# EAGLE board blades_v40 (EAGLE 5.09), part 1 of 2
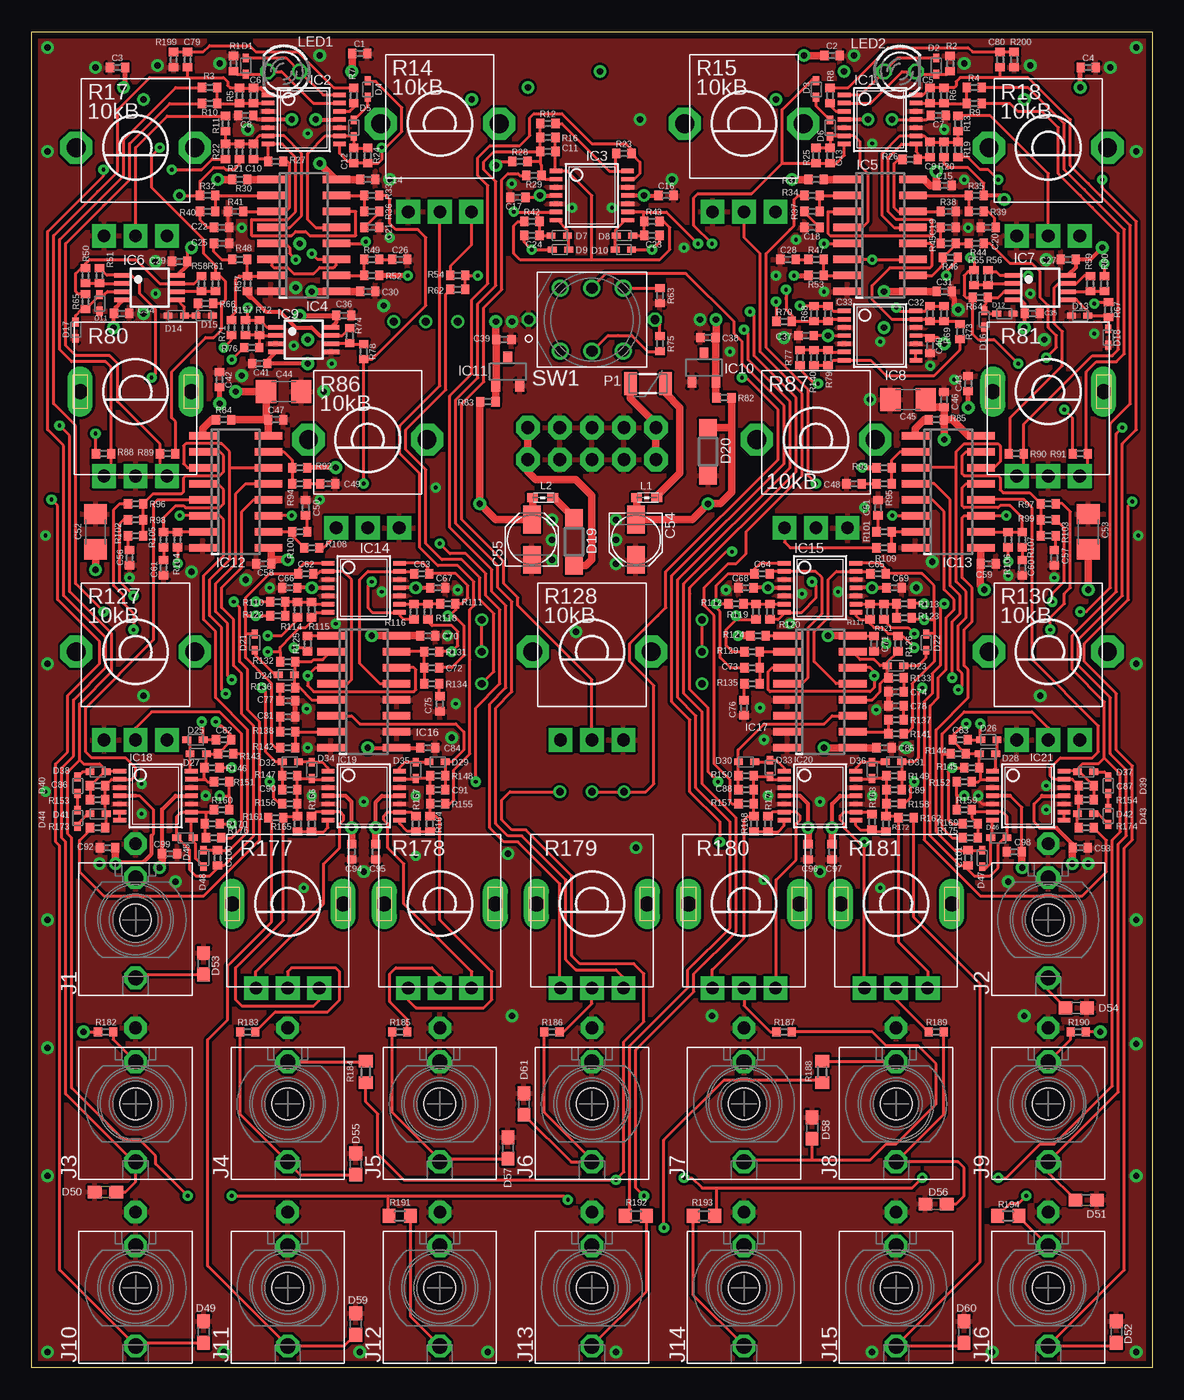
[diagram p6: board, top side]
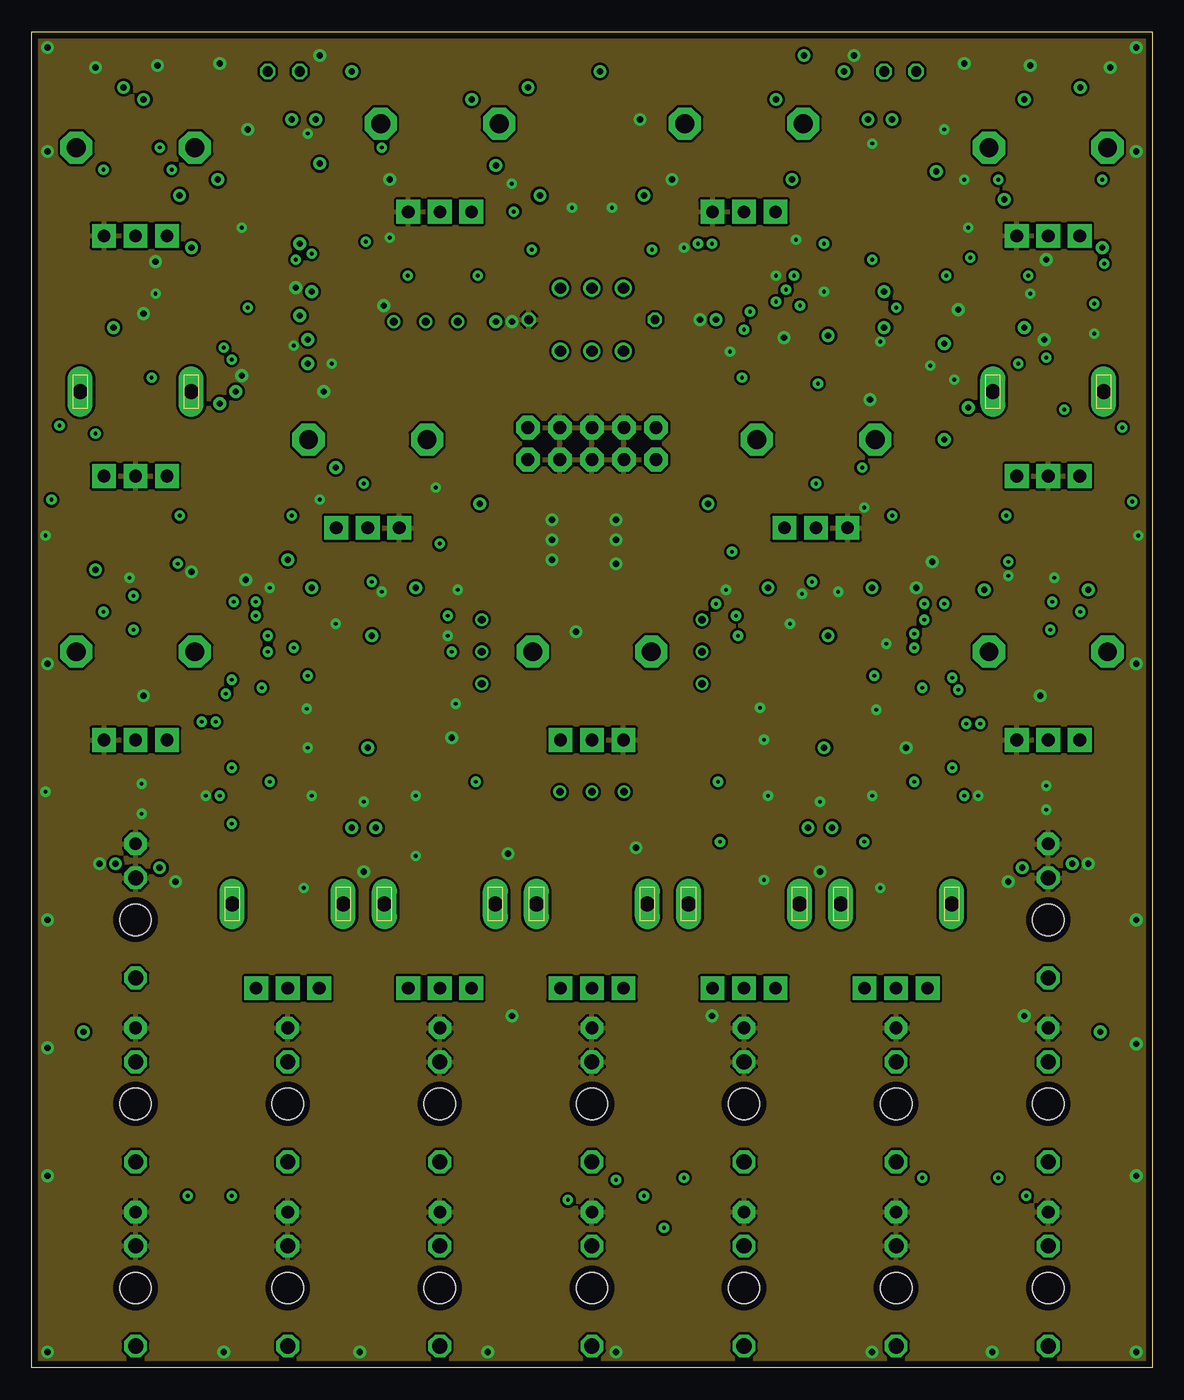
[diagram p7: board, inner layer InternalGround]
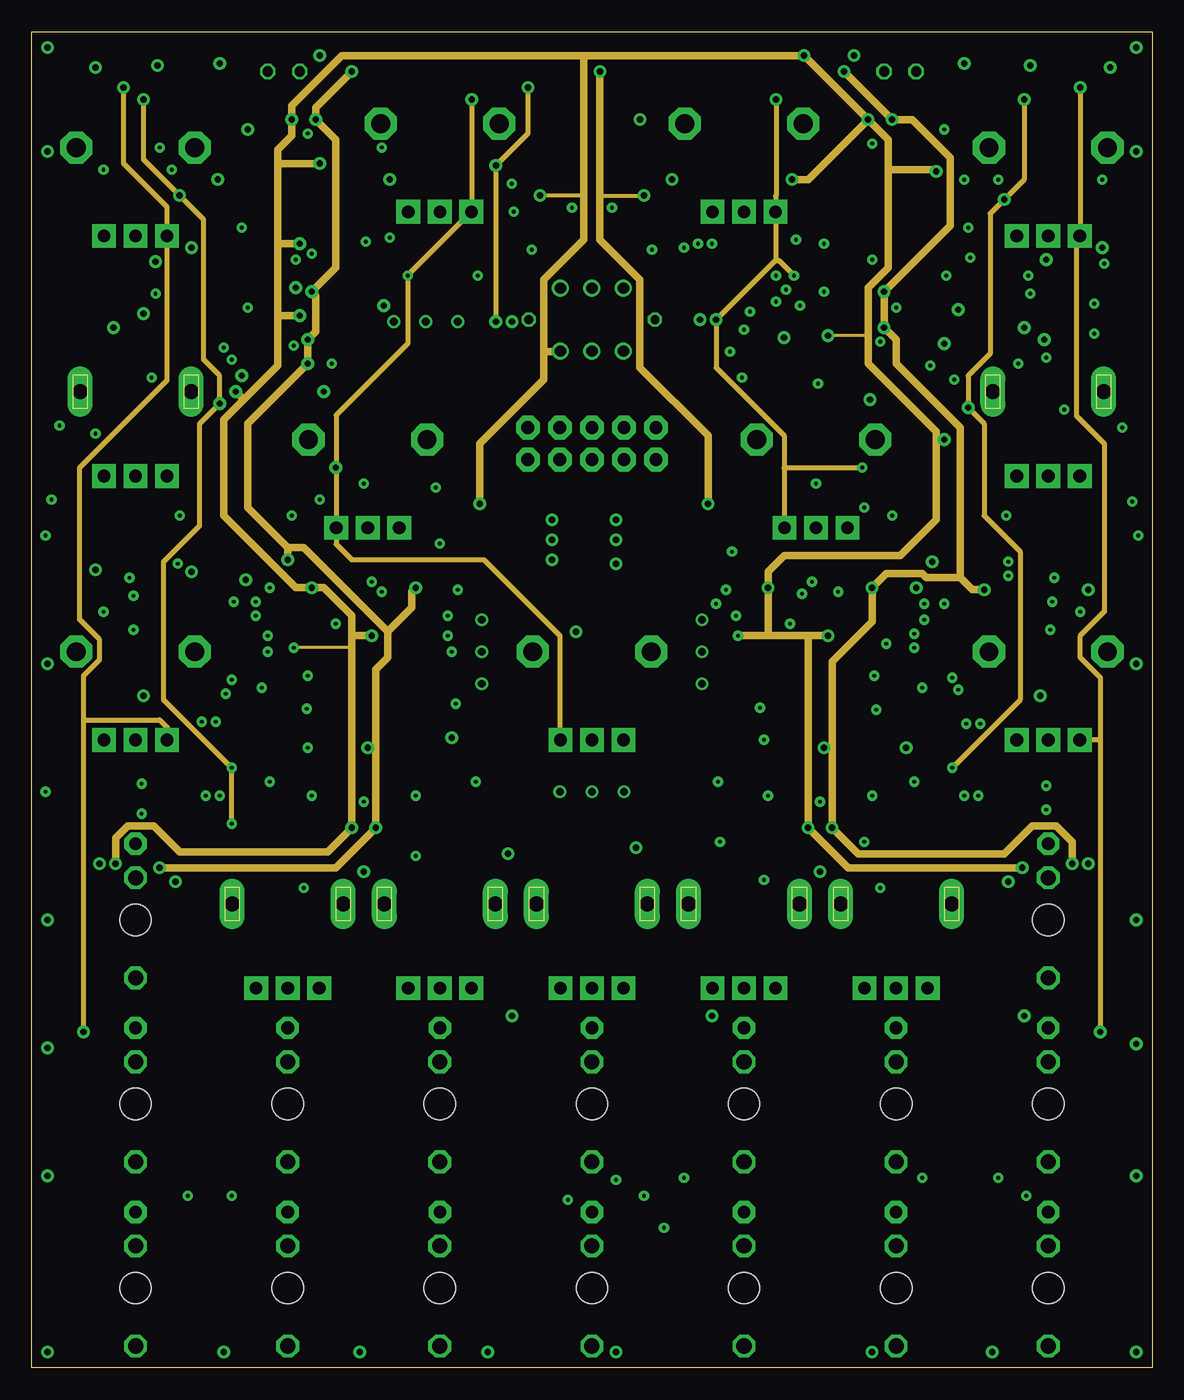
[diagram p8: board, inner layer Supplies]
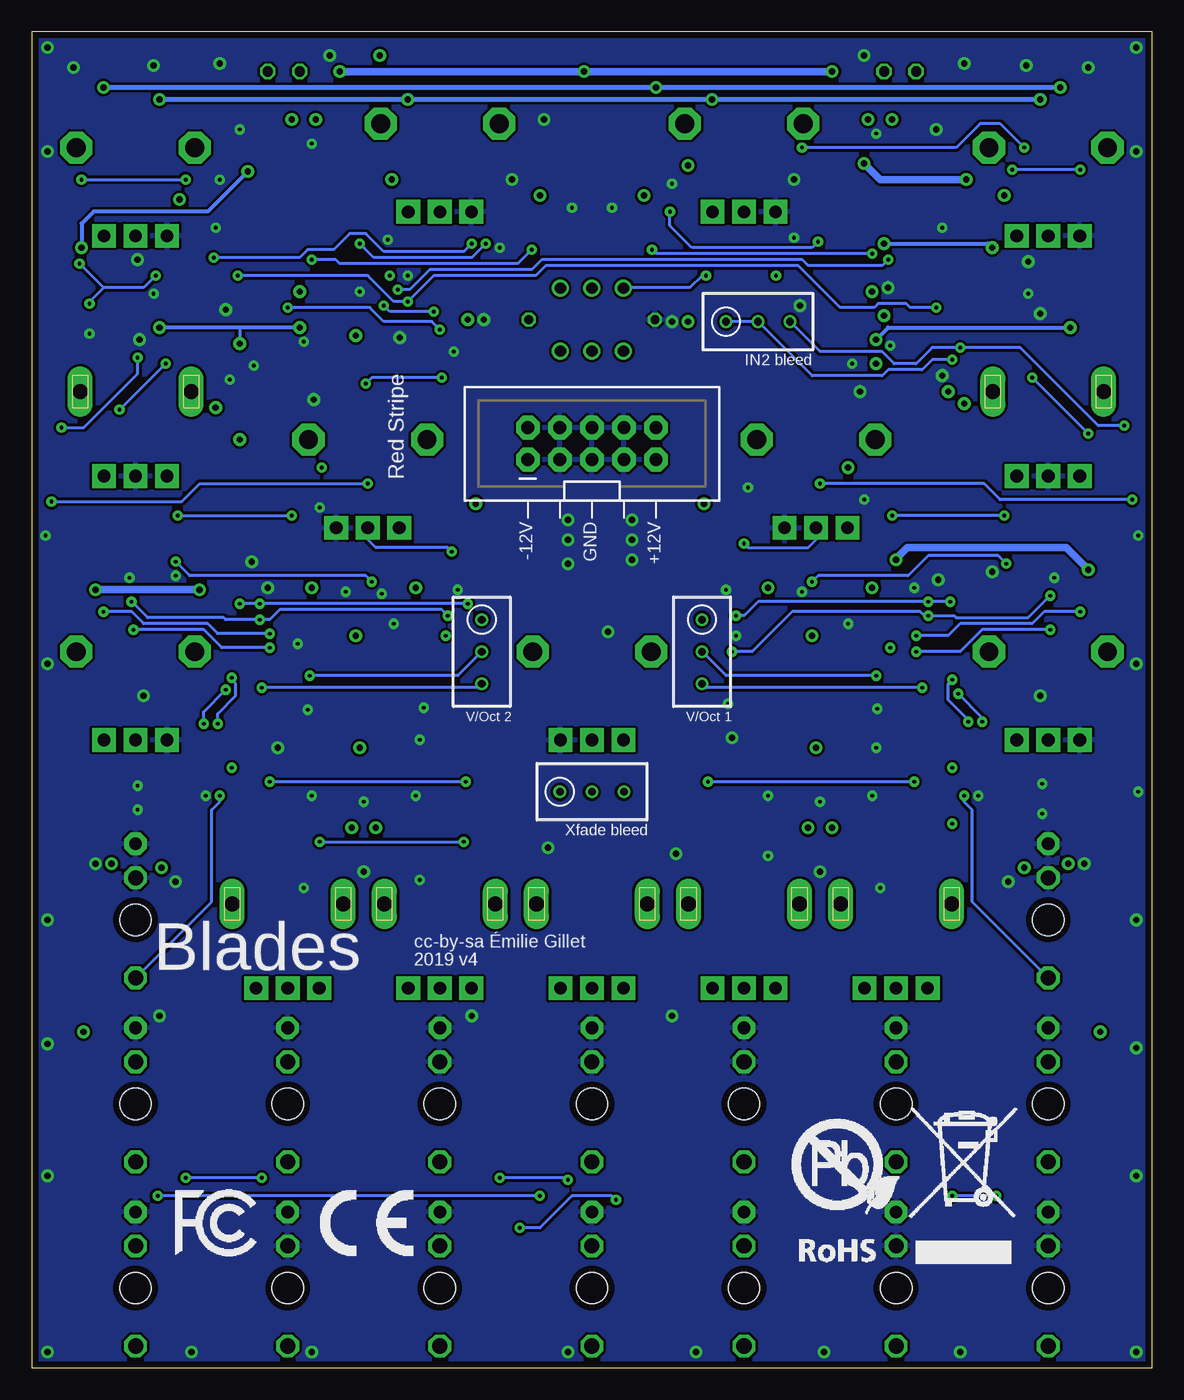
[diagram p9: board, bottom side, seen from below]

Size 88.9 x 106.05 mm. Coordinates in mm from the lower left corner, seen from the top.
Outline: 0,0 0,106.05 88.9,106.05 88.9,0 0,0
Copper layers (1+2*15+16): Top 0.05mm / dielectric 0.3mm / InternalGround 0.05mm / dielectric 0.75mm / Supplies 0.035mm / dielectric 0.2mm / Bottom 0.05mm
Design rules "PCBCart-Standard-4L *": minimum track width 8mil, minimum drill 0.3mm, track to track 8mil, track to pad 8mil, pad to pad 8mil, via to via 8mil, smd to smd 8mil, copper to edge 20mil, drill to drill 8mil, minimum pad ring 8mil, minimum via ring 10mil, stop-mask expansion 3mil, vias tented up to drill 25mil, thermal gap 8mil

## Footprints (pad centres in the part's own frame; a part is rotated, then mirrored left to right if it is on the bottom)
C0402 = smd 0.65 x 0.75: 1 -0.6,0; 2 0.6,0
C1206 = smd 1.6 x 1.8: 1 -1.4,0; 2 1.4,0
PANASONIC_B = smd 2.2 x 1.4: + 1.6,0; - -1.6,0
SOD523 = smd 0.7 x 0.5: A 0.7,0; C -0.6,0
SOD123 = smd 1.4 x 1.4: A 1.9,0; C -1.9,0
0603 = smd 1.1 x 1: 1 -0.85,0; 2 0.85,0
TSSOP14_065 = smd 0.35 x 1: 1 -1.95,-2.845; 2 -1.3,-2.845; 3 -0.65,-2.845; 4 0,-2.845; 5 0.65,-2.845; 6 1.3,-2.845; 7 1.95,-2.845; 8 1.95,2.845; 9 1.3,2.845; 10 0.65,2.845; 11 0,2.845; 12 -0.65,2.845; 13 -1.3,2.845; 14 -1.95,2.825
SOIC16N = smd 0.6 x 2.2: 1 -4.445,-2.6; 2 -3.175,-2.6; 3 -1.905,-2.6; 4 -0.635,-2.6; 5 0.635,-2.6; 6 1.905,-2.6; 7 3.175,-2.6; 8 4.445,-2.6; 9 4.445,2.6; 10 3.175,2.6; 11 1.905,2.6; 12 0.635,2.6; 13 -0.635,2.6; 14 -1.905,2.6; 15 -3.175,2.6; 16 -4.445,2.6
VSSOP8 = smd 0.35 x 1.2: 1 -0.975,-2.2; 2 -0.325,-2.2; 3 0.325,-2.2; 4 0.975,-2.2; 5 0.975,2.2; 6 0.325,2.2; 7 -0.325,2.2; 8 -0.975,2.2
DBZ_R-PDSO-G3 = smd 0.7 x 1: 1 -0.95,-1.1; 2 0.95,-1.1; 3 0,1.1
WQP_PJ_301M_TME = drill 1 pad 1.778 octagon: P1 0,-6.032 | drill 1.2 pad 1.778 octagon: P2 0,-3.334; P3 0,4.604 | hole 2.5: 0,0
2X5-SHROUDED = drill 1.016 pad 1.88 octagon: 1 -1.27,5.08; 2 1.27,5.08; 3 -1.27,2.54; 4 1.27,2.54; 5 -1.27,0; 6 1.27,0; 7 -1.27,-2.54; 8 1.27,-2.54; 9 -1.27,-5.08; 10 1.27,-5.08
0603' = smd 0.85 x 0.7: 1 -0.9,0; 2 0.7,0
LED3MM = drill 0.813 octagon: A -1.27,0; K 1.27,0
PTC-1206 = smd 1 x 1.8: 1 -1.4,0; 2 1.4,0
R0402 = smd 0.65 x 0.75: 1 -0.6,0; 2 0.6,0
ALPS_POT_VERTICAL_PS = drill 1 pad 1.88 square: P$1 -2.5,7; P$2 0,7; P$3 2.5,7 | drill 1.5 pad 2.54 octagon: P$4 -4.7,0; P$5 4.7,0
ALPS_POT_NARROW = drill 1 pad 1.88 square: P$1 -2.5,6.7; P$2 0,6.7; P$3 2.5,6.7 | drill 1.2 pad 2 long: P$4 -4.4,0; P$5 4.4,0
RTRIM3296W = drill 0.61 round: 1 0,-2.54; 2 0,0; 3 0,2.54
R0603 = smd 1 x 1.1: 1 -0.85,0; 2 0.85,0
LP4OA1PBCT = drill 0.7 octagon: L1 5,0; L2 -5,0 | drill 0.9 round: P1 2.5,2.5; P2 0,2.5; P3 -2.5,2.5; P4 2.5,-2.5; P5 0,-2.5; P6 -2.5,-2.5

## Placement (x,y rotation side)
C1  100n  [C0402]  26.04,104.3 180 top
C2  100n  [C0402]  63.5,104.14 0 top
C3  100n  [C0402]  6.83,103.19 180 top
C4  100n  [C0402]  83.82,103.19 0 top
C5  18p  [C0402]  71.28,100.97 90 top
C6  18p  [C0402]  17.62,100.97 90 top
C7  100n  [C0402]  71.91,99.38 180 top
C8  100n  [C0402]  16.99,99.38 180 top
C9  220p  [C0402]  71.28,96.68 270 top
C10  220p  [C0402]  17.62,96.52 270 top
C11  220p  [C0402]  40.96,96.52 0 top
C12  18p  [C0402]  25.56,96.2 270 top
C13  18p  [C0402]  63.34,96.2 270 top
C14  100n  [C0402]  26.67,94.3 0 top
C15  100n  [C0402]  72.39,93.82 0 top
C16  100n  [C0402]  50.32,93.03 180 top
C17  100n  [C0402]  38.58,92.87 180 top
C18  560p  [C0402]  61.91,90.49 180 top
C19  560p  [C0402]  72.71,90.49 0 top
C20  560p  [C0402]  75.88,90.49 180 top
C21  560p  [C0402]  26.99,90.49 0 top
C22  560p  [C0402]  15.08,90.49 0 top
C23  220p  [C0402]  49.21,89.85 0 top
C24  220p  [C0402]  39.69,89.85 180 top
C25  560p  [C0402]  15.08,89.22 0 top
C26  560p  [C0402]  29.21,87.95 0 top
C27  100n  [C0402]  82.23,87.95 180 top
C28  560p  [C0402]  60.01,87.95 180 top
C29  100n  [C0402]  11.75,87.79 180 top
C30  100n  [C0402]  26.67,85.41 180 top
C31  100n  [C0402]  72.39,85.41 180 top
C32  18p  [C0402]  71.28,83.66 90 top
C33  18p  [C0402]  63.18,83.66 90 top
C34  100n  [C0402]  7.14,83.66 180 top
C35  100n  [C0402]  79.37,83.66 180 top
C36  100n  [C0402]  24.77,83.5 0 top
C37  100n  [C0402]  61.44,81.92 180 top
C38  100n  [C0402]  53.66,81.76 180 top
C39  100n  [C0402]  37.47,81.6 0 top
C40  100n  [C0402]  71.28,81.12 90 top
C41  100n  [C0402]  18.1,79.69 0 top
C42  100n  [C0402]  14.92,78.42 90 top
C43  100n  [C0402]  74.3,78.11 90 top
C44  22u  [C1206]  20,77.47 0 top
C45  22u  [C1206]  69.53,76.83 180 top
C46  100n  [C0402]  72.39,76.83 90 top
C47  100n  [C0402]  19.37,75.25 0 top
C48  560p  [C0402]  65.25,70.17 180 top
C49  560p  [C0402]  23.49,70.17 0 top
C50  560p  [C0402]  21.75,68.26 90 top
C51  560p  [C0402]  67.15,68.26 90 top
C52  22u  [C1206]  5.08,66.36 270 top
C53  22u  [C1206]  83.82,66.36 270 top
C54  22u  [PANASONIC_B]  47.94,65.72 270 top
C55  22u  [PANASONIC_B]  39.69,65.72 90 top
C56  560p  [C0402]  7.78,64.29 270 top
C57  560p  [C0402]  81.12,64.29 270 top
C58  100n  [C0402]  18.41,63.82 0 top
C59  100n  [C0402]  75.88,63.82 180 top
C60  560p  [C0402]  78.58,63.5 270 top
C61  560p  [C0402]  10.48,63.5 270 top
C62  220p  [C0402]  21.75,63.02 180 top
C63  220p  [C0402]  30.96,63.02 0 top
C64  220p  [C0402]  57.94,63.02 180 top
C65  220p  [C0402]  67.15,63.02 0 top
C66  100n  [C0402]  20.48,61.91 180 top
C67  100n  [C0402]  32.23,61.91 180 top
C68  100n  [C0402]  56.67,61.91 180 top
C69  100n  [C0402]  68.42,61.91 180 top
C70  100n  [C0402]  31.43,58.1 0 top
C71  100n  [C0402]  66.83,57.47 270 top
C72  DNP  [C0402]  31.75,55.56 0 top
C73  DNP  [C0402]  57.15,55.56 180 top
C74  560p  [C0402]  68.58,53.66 180 top
C75  560p  [C0402]  32.39,52.71 270 top
C76  560p  [C0402]  56.52,52.39 270 top
C77  560p  [C0402]  20.32,52.94 0 top
C78  560p  [C0402]  68.58,52.55 180 top
C79  100n  [C0402]  12.38,103.82 90 top
C80  100n  [C0402]  76.83,103.82 90 top
C81  560p  [C0402]  20.32,51.67 0 top
C82  220p  [C0402]  15.24,49.85 180 top
C83  220p  [C0402]  73.66,49.85 0 top
C84  100n  [C0402]  31.43,49.21 180 top
C85  100n  [C0402]  67.63,49.21 180 top
C86  18p  [C0402]  5.24,46.2 180 top
C87  18p  [C0402]  83.66,46.2 0 top
C88  220p  [C0402]  56.67,45.88 180 top
C89  220p  [C0402]  68.42,45.88 0 top
C90  220p  [C0402]  20.48,45.88 180 top
C91  220p  [C0402]  32.23,45.88 0 top
C92  100n  [C0402]  6.03,41.27 180 top
C93  100n  [C0402]  83.19,41.27 180 top
C94  100n  [C0402]  25.4,40.96 270 top
C95  100n  [C0402]  27.3,40.96 90 top
C96  100n  [C0402]  61.59,40.96 270 top
C97  100n  [C0402]  63.5,40.96 90 top
C98  100n  [C0402]  77.95,40.96 180 top
C99  100n  [C0402]  10.95,40.8 180 top
C100  220p  [C0402]  14.76,40.48 90 top
C101  220p  [C0402]  74.3,40.48 90 top
D1  1N4148  [SOD523]  16.99,103.35 270 top
D2  1N4148  [SOD523]  71.75,103.35 270 top
D3  BZT585B5V1T  [SOD523]  62.23,101.44 90 top
D4  BZT585B5V1T  [SOD523]  26.67,101.44 90 top
D5  BZT585B5V1T  [SOD523]  25.56,98.42 270 top
D6  BZT585B5V1T  [SOD523]  63.34,98.42 270 top
D7  1N4148  [SOD523]  41.91,89.85 180 top
D8  1N4148  [SOD523]  46.99,89.85 0 top
D9  1N4148  [SOD523]  41.91,88.74 0 top
D10  1N4148  [SOD523]  46.99,88.74 180 top
D11  1N4148  [SOD523]  5.4,84.46 90 top
D12  1N4148  [SOD523]  77.15,83.66 0 top
D13  1N4148  [SOD523]  83.18,83.5 180 top
D14  1N4148  [SOD523]  11.43,83.5 0 top
D15  1N4148  [SOD523]  13.65,83.5 0 top
D16  1N4148  [SOD523]  75.56,83.18 90 top
D17  1N4148  [SOD523]  3.49,82.39 270 top
D18  1N4148  [SOD523]  85.41,81.76 90 top
D19  1N5819HW  [SOD123]  43.02,65.56 270 top
D20  1N5819HW  [SOD123]  53.66,72.71 90 top
D21  BZT585B5V1T  [SOD523]  17.7,57.55 90 top
D22  BZT585B5V1T  [SOD523]  70.96,57.55 90 top
D23  BZT585B5V1T  [SOD523]  68.58,55.72 180 top
D24  BZT585B5V1T  [SOD523]  20.16,55.01 0 top
D25  1N4148  [SOD523]  13.02,49.85 180 top
D26  1N4148  [SOD523]  75.88,49.85 0 top
D27  1N4148  [SOD523]  13.18,48.74 0 top
D28  1N4148  [SOD523]  75.88,48.74 180 top
D29  1N4148  [SOD523]  32.23,48.1 180 top
D30  1N4148  [SOD523]  56.67,48.1 0 top
D31  1N4148  [SOD523]  68.42,48.1 180 top
D32  1N4148  [SOD523]  20.48,48.1 0 top
D33  1N4148  [SOD523]  58.58,47.62 270 top
D34  1N4148  [SOD523]  22.23,47.47 270 top
D35  1N4148  [SOD523]  30.48,47.47 270 top
D36  1N4148  [SOD523]  66.67,47.47 270 top
D37  BZT585B5V1T  [SOD523]  83.66,47.31 180 top
D38  BZT585B5V1T  [SOD523]  5.24,47.31 0 top
D39  BZT585B5V1T  [SOD523]  85.41,46.2 90 top
D40  BZT585B5V1T  [SOD523]  3.65,46.2 90 top
D41  BZT585B5V1T  [SOD523]  5.24,43.97 0 top
D42  BZT585B5V1T  [SOD523]  83.66,43.97 180 top
D43  BZT585B5V1T  [SOD523]  85.41,43.81 270 top
D44  BZT585B5V1T  [SOD523]  3.65,43.66 270 top
D45  1N4148  [SOD523]  12.22,42.07 180 top
D46  1N4148  [SOD523]  76.68,42.07 0 top
D47  1N4148  [SOD523]  75.41,40.48 270 top
D48  1N4148  [SOD523]  13.65,40.48 270 top
D49  TVS  [0603]  13.65,2.86 270 top
D50  TVS  [0603]  5.87,13.97 0 top
D51  TVS  [0603]  83.66,13.34 180 top
D52  TVS  [0603]  86.04,2.86 270 top
D53  TVS  [0603]  13.65,32.07 270 top
D54  TVS  [0603]  82.87,28.57 180 top
D55  TVS  [0603]  25.72,16.19 270 top
D56  TVS  [0603]  71.75,13.02 0 top
D57  TVS  [0603]  37.78,17.46 270 top
D58  TVS  [0603]  61.91,19.05 270 top
D59  TVS  [0603]  25.72,3.49 270 top
D60  TVS  [0603]  73.98,2.86 270 top
D61  TVS  [0603]  39.05,20.95 270 top
IC1  OPA1679  [TSSOP14_065]  67.31,99.06 270 top
IC2  OPA1679  [TSSOP14_065]  21.59,99.06 270 top
IC3  TL074  [TSSOP14_065]  44.45,93.03 270 top
IC4  V2164SZ  [SOIC16N]  21.59,89.85 270 top
IC5  V2164SZ  [SOIC16N]  67.31,89.85 270 top
IC6  OPA1678  [VSSOP8]  9.37,85.72 270 top
IC7  OPA1678  [VSSOP8]  80.01,85.72 270 top
IC8  OPA1679  [TSSOP14_065]  67.31,81.92 270 top
IC9  OPA1678  [VSSOP8]  21.59,81.6 270 top
IC10  LM4040B5  [DBZ_R-PDSO-G3]  53.34,79.38 0 top
IC11  LM4040B5  [DBZ_R-PDSO-G3]  37.78,79.06 0 top
IC12  V2164SZ  [SOIC16N]  16.19,69.53 270 top
IC13  V2164SZ  [SOIC16N]  72.71,69.53 270 top
IC14  OPA1679  [TSSOP14_065]  26.35,61.91 270 top
IC15  OPA1679  [TSSOP14_065]  62.55,61.91 270 top
IC16  V2164SZ  [SOIC16N]  26.35,53.66 270 top
IC17  V2164SZ  [SOIC16N]  62.55,53.66 270 top
IC18  OPA1679  [TSSOP14_065]  9.84,45.4 270 top
IC19  TL074  [TSSOP14_065]  26.35,45.4 270 top
IC20  TL074  [TSSOP14_065]  62.55,45.4 270 top
IC21  OPA1679  [TSSOP14_065]  79.06,45.4 270 top
J1  PJ301_THONKICONNTME  [WQP_PJ_301M_TME]  8.26,35.56 180 top
J2  PJ301_THONKICONNTME  [WQP_PJ_301M_TME]  80.64,35.56 180 top
J3  PJ301_THONKICONNTME  [WQP_PJ_301M_TME]  8.26,20.95 180 top
J4  PJ301_THONKICONNTME  [WQP_PJ_301M_TME]  20.32,20.95 180 top
J5  PJ301_THONKICONNTME  [WQP_PJ_301M_TME]  32.38,20.95 180 top
J6  PJ301_THONKICONNTME  [WQP_PJ_301M_TME]  44.45,20.95 180 top
J7  PJ301_THONKICONNTME  [WQP_PJ_301M_TME]  56.52,20.95 180 top
J8  PJ301_THONKICONNTME  [WQP_PJ_301M_TME]  68.58,20.95 180 top
J9  PJ301_THONKICONNTME  [WQP_PJ_301M_TME]  80.64,20.95 180 top
J10  PJ301_THONKICONNTME  [WQP_PJ_301M_TME]  8.26,6.35 180 top
J11  PJ301_THONKICONNTME  [WQP_PJ_301M_TME]  20.32,6.35 180 top
J12  PJ301_THONKICONNTME  [WQP_PJ_301M_TME]  32.38,6.35 180 top
J13  PJ301_THONKICONNTME  [WQP_PJ_301M_TME]  44.45,6.35 180 top
J14  PJ301_THONKICONNTME  [WQP_PJ_301M_TME]  56.52,6.35 180 top
J15  PJ301_THONKICONNTME  [WQP_PJ_301M_TME]  68.58,6.35 180 top
J16  PJ301_THONKICONNTME  [WQP_PJ_301M_TME]  80.64,6.35 180 top
JP1  M05X2SHD  [2X5-SHROUDED]  44.45,73.34 90 bottom
L1  742792664  [0603']  48.9,69.06 0 top
L2  742792664  [0603']  40.64,69.06 0 top
LED1  OSC84L3131A  [LED3MM]  20,102.87 180 top
LED2  OSC54L3131A  [LED3MM]  68.9,102.87 0 top
P1  PTCSMD  [PTC-1206]  48.9,78.11 180 top
R1  6.2k  [R0402]  16.03,103.5 90 top
R2  6.2k  [R0402]  72.87,103.5 90 top
R3  5.1k  [R0402]  14.13,101.6 0 top
R4  62.0k  [R0402]  74.77,101.6 180 top
R5  200.0k  [R0402]  16.51,100.97 90 top
R6  200.0k  [R0402]  72.39,100.97 90 top
R7  30k  [R0402]  25.56,100.97 270 top
R8  30k  [R0402]  63.34,100.97 270 top
R9  5.1k  [R0402]  74.77,100.33 180 top
R10  62.0k  [R0402]  14.13,100.33 0 top
R11  62.0k  [R0402]  15.4,98.74 270 top
R12  100.0k  [R0402]  40.96,98.74 180 top
R13  62.0k  [R0402]  73.5,98.74 270 top
R14  10kB  [ALPS_POT_VERTICAL_PS]  32.38,98.74 180 top
R15  10kB  [ALPS_POT_VERTICAL_PS]  56.52,98.74 180 top
R16  100.0k  [R0402]  40.96,97.63 0 top
R17  10kB  [ALPS_POT_VERTICAL_PS]  8.26,96.84 180 top
R18  10kB  [ALPS_POT_VERTICAL_PS]  80.64,96.84 180 top
R19  100k  [R0402]  73.5,96.68 90 top
R20  10M  [R0402]  72.39,96.68 90 top
R21  10M  [R0402]  16.51,96.52 90 top
R22  100k  [R0402]  15.4,96.52 90 top
R23  100.0k  [R0402]  46.99,96.36 180 top
R24  30k  [R0402]  26.67,96.2 270 top
R25  30k  [R0402]  62.23,96.2 270 top
R26  5.1k  [R0402]  69.69,95.89 0 top
R27  5.1k  [R0402]  19.37,95.73 180 top
R28  3.9M  [R0402]  38.73,95.73 0 top
R29  95.3k  [R0402]  39.85,94.62 0 top
R30  6.2k  [R0402]  16.51,94.3 180 top
R31  6.2k  [R0402]  62.23,94.3 180 top
R32  100k  [R0402]  13.97,93.03 0 top
R33  30k  [R0402]  26.99,93.03 180 top
R34  30k  [R0402]  61.91,93.03 0 top
R35  100k  [R0402]  74.93,93.03 180 top
R36  510  [R0402]  26.99,91.76 180 top
R37  510  [R0402]  61.91,91.76 0 top
R38  5.1k  [R0402]  72.71,91.76 180 top
R39  510  [R0402]  74.93,91.76 180 top
R40  510  [R0402]  13.97,91.76 0 top
R41  5.1k  [R0402]  16.19,91.76 0 top
R42  100.0k  [R0402]  39.69,90.96 0 top
R43  100.0k  [R0402]  49.21,90.96 180 top
R44  62.0k  [R0402]  74.93,89.22 180 top
R45  510  [R0402]  72.71,89.22 0 top
R46  62.0k  [R0402]  72.87,88.11 180 top
R47  510  [R0402]  62.23,87.95 0 top
R48  510  [R0402]  16.51,87.95 0 top
R49  510  [R0402]  26.99,87.95 180 top
R50  100k  [R0402]  4.29,86.68 270 top
R51  100k  [R0402]  5.4,86.68 90 top
R52  200.0k  [R0402]  26.99,86.68 180 top
R53  100.0k  [R0402]  62.23,86.68 0 top
R54  88.7k  [R0402]  33.81,86.68 0 top
R55  100k  [R0402]  74.77,86.52 270 top
R56  30k  [R0402]  75.88,86.52 90 top
R57  62.0k  [R0402]  17.14,86.04 90 top
R58  30k  [R0402]  13.49,86.04 90 top
R59  100k  [R0402]  83.98,86.04 90 top
R60  100k  [R0402]  85.09,86.04 270 top
R61  100k  [R0402]  14.6,86.04 270 top
R62  30.0k  [R0402]  33.81,85.57 0 top
R63  100k  [R0402]  49.85,85.09 270 top
R64  100k  [R0402]  75.25,84.93 0 top
R65  100k  [R0402]  4.29,84.61 270 top
R66  100k  [R0402]  13.81,84.45 180 top
R67  100k  [R0402]  85.41,83.98 270 top
R68  62.0k  [R0402]  62.07,83.66 90 top
R69  62.0k  [R0402]  72.39,83.66 90 top
R70  62.0k  [R0402]  59.69,83.03 0 top
R71  62.0k  [R0402]  15.88,82.55 90 top
R72  62.0k  [R0402]  18.1,82.55 90 top
R73  62.0k  [R0402]  73.66,82.23 90 top
R74  30.0k  [R0402]  25.24,81.92 90 top
R75  510  [R0402]  49.85,81.28 90 top
R76  30.0k  [R0402]  17.46,80.96 0 top
R77  30.0k  [R0402]  60.96,80.17 90 top
R78  30.0k  [R0402]  26.35,80.64 90 top
R79  62.0k  [R0402]  63.18,80.17 270 top
R80  10kA  [ALPS_POT_NARROW]  8.26,77.47 180 top
R81  10kA  [ALPS_POT_NARROW]  80.64,77.47 180 top
R82  1.8k  [R0402]  54.93,76.99 180 top
R83  1.8k  [R0402]  36.19,76.68 0 top
R84  680k  [R0402]  15.24,75.25 0 top
R85  680k  [R0402]  71.75,75.25 0 top
R86  10kB  [ALPS_POT_VERTICAL_PS]  26.67,73.66 180 top
R87  10kB  [ALPS_POT_VERTICAL_PS]  62.23,73.66 180 top
R88  5.1k  [R0402]  5.71,72.55 0 top
R89  30k  [R0402]  10.8,72.55 180 top
R90  5.1k  [R0402]  78.11,72.55 0 top
R91  30k  [R0402]  83.19,72.55 0 top
R92  200.0k  [R0402]  21.27,71.44 180 top
R93  200.0k  [R0402]  67.63,71.44 0 top
R94  510  [R0402]  21.27,70.17 180 top
R95  510  [R0402]  67.63,70.17 0 top
R96  62.0k  [R0402]  8.26,68.58 0 top
R97  62.0k  [R0402]  80.65,68.58 180 top
R98  62.0k  [R0402]  8.26,67.31 0 top
R99  62.0k  [R0402]  80.64,67.31 180 top
R100  510  [R0402]  21.27,66.36 180 top
R101  510  [R0402]  67.63,66.36 0 top
R102  510  [R0402]  8.26,66.04 0 top
R103  510  [R0402]  80.64,66.04 180 top
R104  30.0k  [R0402]  11.59,65.72 90 top
R105  510  [R0402]  10.48,65.72 90 top
R106  30.0k  [R0402]  77.47,65.72 90 top
R107  510  [R0402]  78.58,65.72 90 top
R108  200.0k  [R0402]  22.23,65.09 180 top
R109  200.0k  [R0402]  67.63,65.09 0 top
R110  30k  [R0402]  19.53,60.8 180 top
R111  62.0k  [R0402]  33.02,60.64 180 top
R112  62.0k  [R0402]  55.88,60.64 0 top
R113  30k  [R0402]  69.22,60.64 0 top
R114  30k  [R0402]  21.11,60.17 90 top
R115  30k  [R0402]  22.23,60.17 270 top
R116  30.0k  [R0402]  30.32,60.01 270 top
R117  30k  [R0402]  66.52,60.01 270 top
R118  62.0k  [R0402]  31.43,60.01 90 top
R119  62.0k  [R0402]  57.47,60.01 90 top
R120  30.0k  [R0402]  58.58,60.01 270 top
R121  30k  [R0402]  67.63,60.01 90 top
R122  300k  [R0402]  19.53,59.69 180 top
R123  300k  [R0402]  69.22,59.53 0 top
R124  680k  [R0402]  57.63,58.1 180 top
R125  680k  [R0402]  21.91,57.47 270 top
R126  30k  [R0402]  68.74,57.47 270 top
R127  10kB  [ALPS_POT_VERTICAL_PS]  8.26,56.83 180 top
R128  10kB  [ALPS_POT_VERTICAL_PS]  44.45,56.83 180 top
R129  30k  [R0402]  57.15,56.83 0 top
R130  10kB  [ALPS_POT_VERTICAL_PS]  80.64,56.83 180 top
R131  30k  [R0402]  31.75,56.83 180 top
R132  30k  [R0402]  20.32,56.04 0 top
R133  510  [R0402]  68.58,54.77 180 top
R134  510  [R0402]  31.75,54.29 180 top
R135  510  [R0402]  57.15,54.29 0 top
R136  510  [R0402]  20.32,53.98 0 top
R137  510  [R0402]  68.58,51.44 180 top
R138  510  [R0402]  20.32,50.48 0 top
R139  2k  [RTRIM3296W]  44.45,45.72 270 bottom
R140  62.0k  [R0402]  62.07,80.17 270 top
R141  15k  [R0402]  68.58,50.32 180 top
R142  15k  [R0402]  20.32,49.21 0 top
R143  100.0k  [R0402]  15.4,48.74 180 top
R144  100.0k  [R0402]  73.5,48.74 0 top
R145  200.0k  [R0402]  74.57,47.63 0 top
R146  200.0k  [R0402]  14.31,47.62 180 top
R147  30.0k  [R0402]  20.48,46.99 180 top
R148  20k  [R0402]  32.23,46.99 0 top
R149  30.0k  [R0402]  68.42,46.99 0 top
R150  20k  [R0402]  56.67,46.99 180 top
R151  100.0k  [R0402]  15.08,46.51 180 top
R152  100.0k  [R0402]  73.98,46.51 0 top
R153  120k  [R0402]  5.24,45.09 180 top
R154  120k  [R0402]  83.66,45.08 0 top
R155  100k  [R0402]  32.23,44.77 180 top
R156  44.2k  [R0402]  20.48,44.77 0 top
R157  100k  [R0402]  56.67,44.77 0 top
R158  44.2k  [R0402]  68.42,44.77 180 top
R159  100.0k  [R0402]  73.98,44.29 0 top
R160  100.0k  [R0402]  15.08,44.29 180 top
R161  100.0k  [R0402]  19.37,43.66 0 top
R162  100.0k  [R0402]  69.37,43.66 180 top
R163  30.0k  [R0402]  66.67,43.34 270 top
R164  20k  [R0402]  31.59,43.18 90 top
R165  30.0k  [R0402]  21.11,43.18 90 top
R166  30.0k  [R0402]  22.23,43.18 270 top
R167  20k  [R0402]  30.48,43.18 270 top
R168  20k  [R0402]  57.31,43.18 90 top
R169  10M  [R0402]  74.45,43.18 0 top
R170  10M  [R0402]  14.34,43.18 180 top
R171  20k  [R0402]  58.42,43.18 270 top
R172  30.0k  [R0402]  67.79,43.18 90 top
R173  62.0k  [R0402]  5.24,42.86 0 top
R174  62.0k  [R0402]  83.66,42.86 180 top
R175  100.0k  [R0402]  74.45,42.07 0 top
R176  100.0k  [R0402]  14.45,42.07 180 top
R177  10kB  [ALPS_POT_NARROW]  20.32,36.83 180 top
R178  10kB  [ALPS_POT_NARROW]  32.38,36.83 180 top
R179  10kB  [ALPS_POT_NARROW]  44.45,36.83 180 top
R180  10kB  [ALPS_POT_NARROW]  56.52,36.83 180 top
R181  10kB  [ALPS_POT_NARROW]  68.58,36.83 180 top
R182  120k  [R0402]  5.87,26.67 180 top
R183  100.0k  [R0402]  17.14,26.67 0 top
R184  DNP  [R0603]  26.51,23.5 90 top
R185  100k  [R0402]  29.21,26.67 0 top
R186  100.0k  [R0402]  41.27,26.67 0 top
R187  100k  [R0402]  59.69,26.67 180 top
R188  DNP  [R0603]  62.71,23.5 90 top
R189  100.0k  [R0402]  71.75,26.67 180 top
R190  120k  [R0402]  83.03,26.67 0 top
R191  1.0k  [R0603]  29.21,12.06 0 top
R192  1.0k  [R0603]  47.94,12.06 0 top
R193  1.0k  [R0603]  53.34,12.06 180 top
R194  1.0k  [R0603]  77.47,12.06 0 top
R195  2k  [RTRIM3296W]  53.18,56.83 180 bottom
R196  2k  [RTRIM3296W]  35.72,56.83 180 bottom
R197  62.0k  [R0402]  16.99,82.55 90 top
R198  2k  [RTRIM3296W]  31.27,83.03 270 bottom
R199  300k  [R0402]  11.27,103.82 90 top
R200  300k  [R0402]  77.95,103.82 90 top
SW1  LP4OA1PBCT  [LP4OA1PBCT]  44.45,83.19 0 top
U$1  [ROHS_BIG]  29.85,7.46 0 bottom
U$2  [FCC_MEDIUM]  77.47,8.89 0 bottom
U$3  [CE_MEDIUM]  66.04,8.89 0 bottom